# Altium schematic sheet TB_Controller.SchDoc
size A3; SheetNumber: 3; SheetTotal: 3
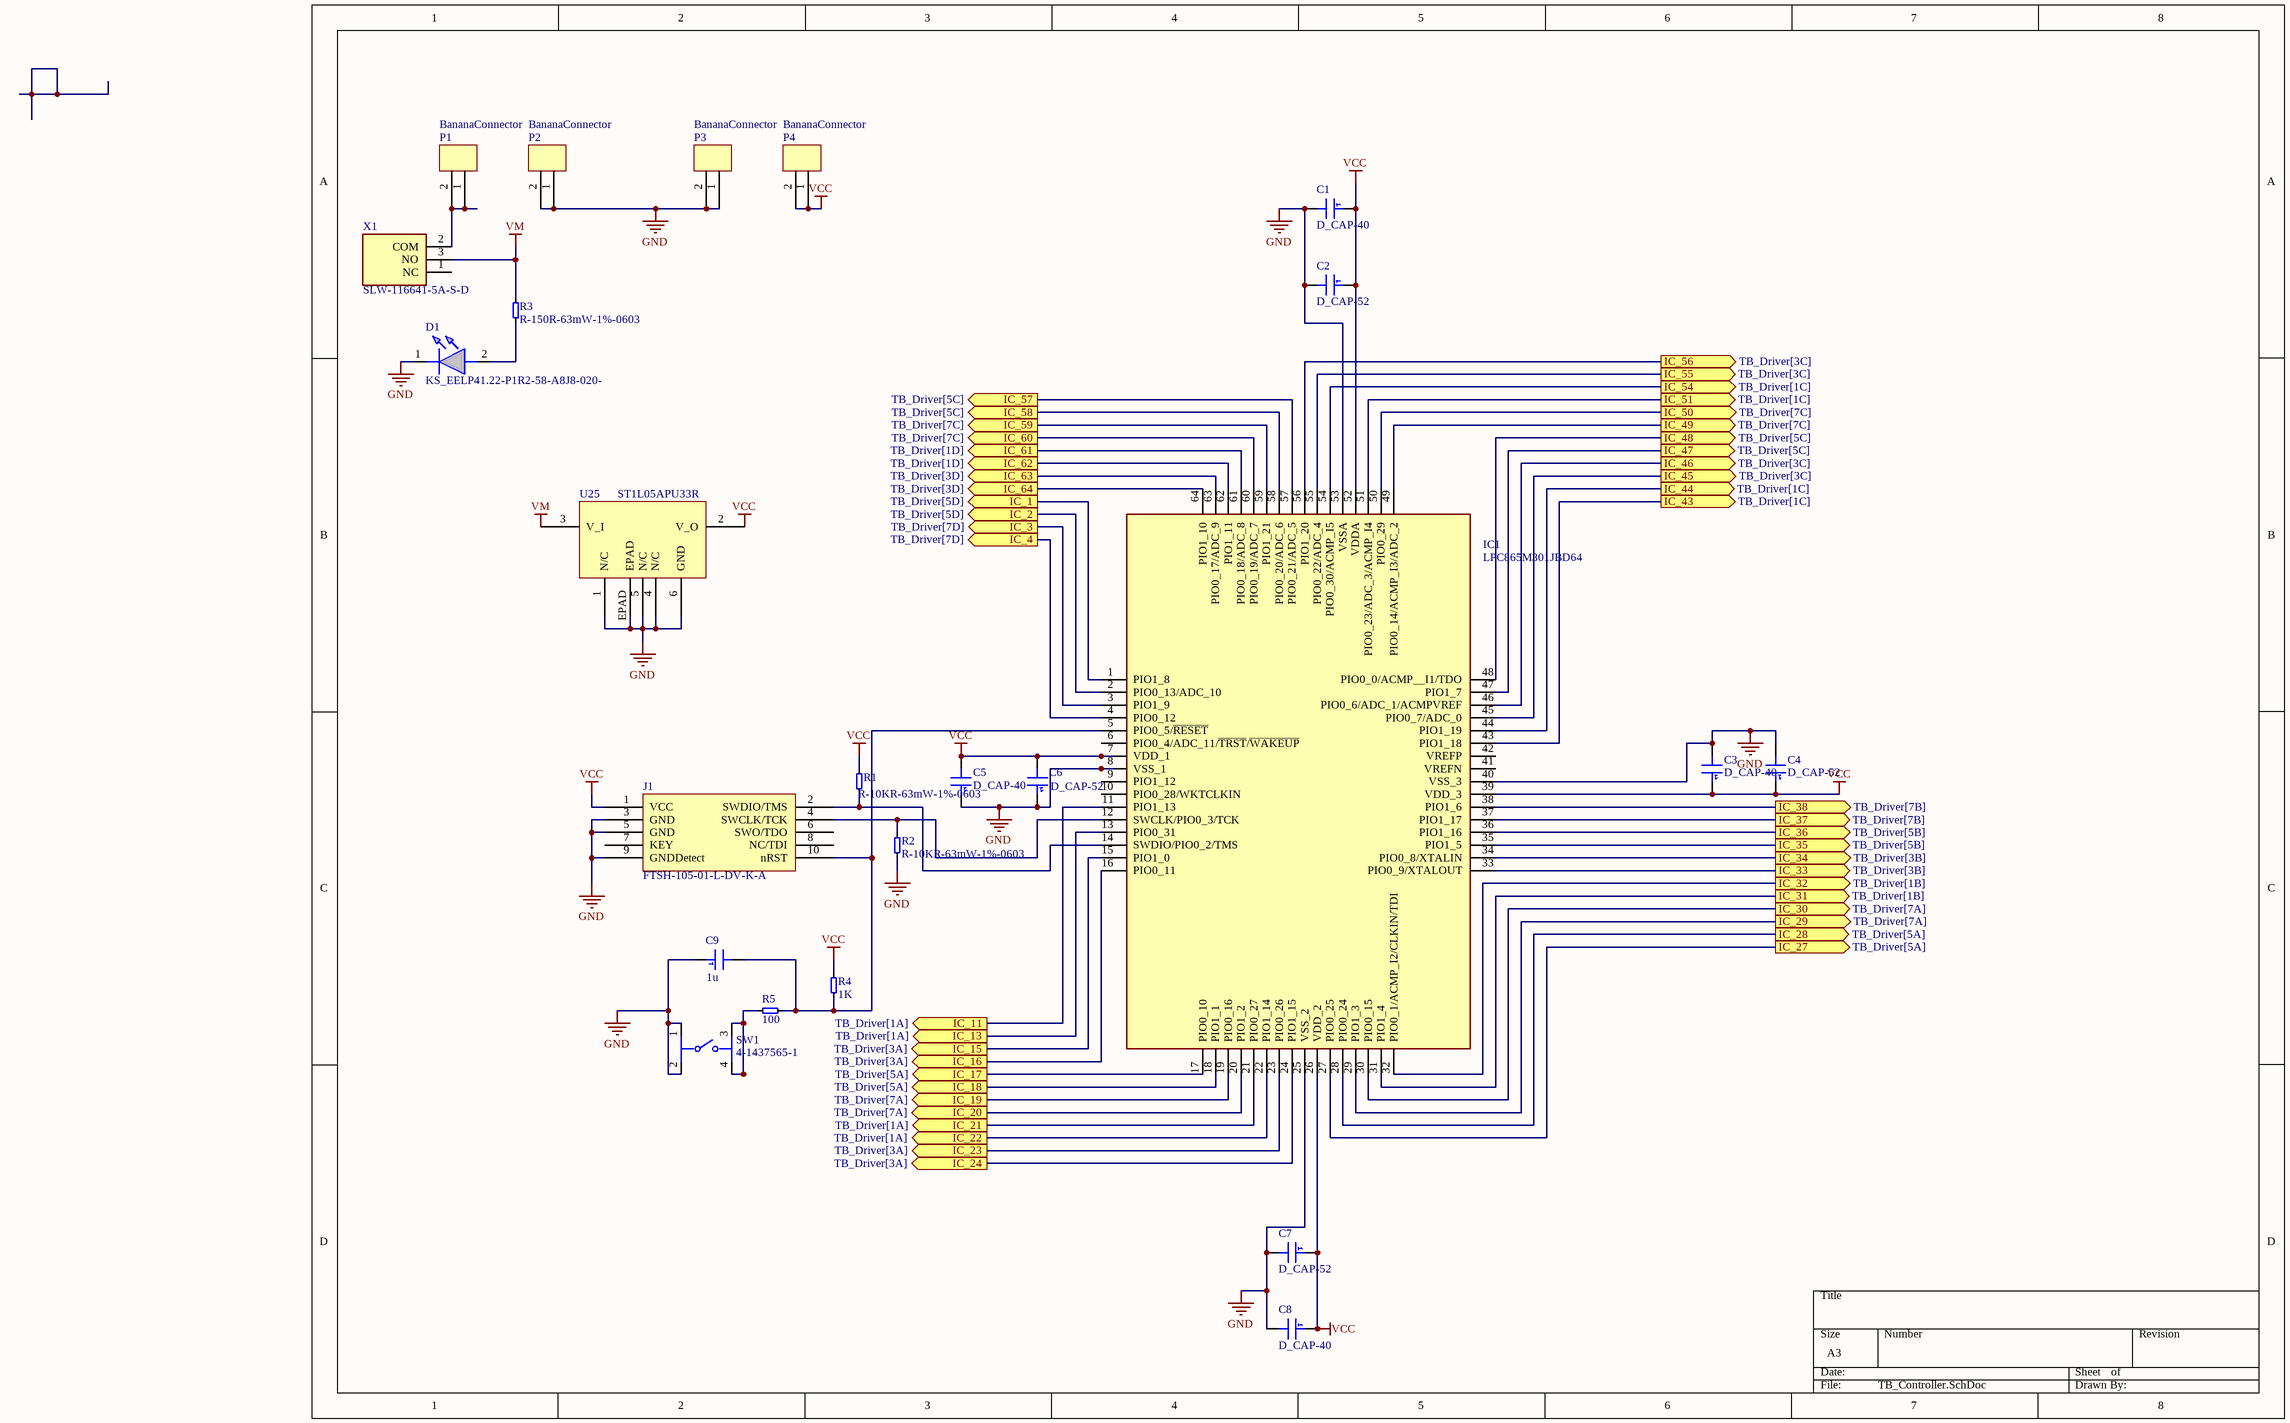
[diagram p0: TB_Controller.SchDoc]

## Parts
C1  D_CAP-40  [CAP_0603H0.8]
C2  D_CAP-52  [CAP_0603H0.8]
C3  D_CAP-40  [CAP_0603H0.8]
C4  D_CAP-52  [CAP_0603H0.8]
C5  D_CAP-40  [CAP_0603H0.8]
C6  D_CAP-52  [CAP_0603H0.8]
C7  D_CAP-52  [CAP_0603H0.8]
C8  D_CAP-40  [CAP_0603H0.8]
C9  1u  [CAP_0603H0.8]
D1  KS_EELP41.22-P1R2-58-A8J8-020-  [KSEELP4122P1R258A8J8020R18]
IC1  LPC865M301JBD64  [LPC865M301JBD64]
J1  FTSH-105-01-L-DV-K-A  [FTSH-105-01-L-DV-K-A]
P1  BananaConnector  [Delton Banana Plug 500 Red]
P2  BananaConnector  [Delton Banana Plug 100 Black]
P3  BananaConnector  [Delton Banana Plug 100 Black]
P4  BananaConnector  [Delton Banana Plug 500 Red]
R1  R-10KR-63mW-1%-0603  [T_RESC0603X30N]
R2  R-10KR-63mW-1%-0603  [T_RESC0603X30N]
R3  R-150R-63mW-1%-0603  [T_RESC0603X30N]
R4  1K  [T_RESC0603X30N]
R5  100  [T_RESC0603X30N]
SW1  4-1437565-1  [FP-4-1437565-1-MFG]
U25  ST1L05APU33R  [ST1L05APU33R]
X1  SLW-116641-5A-S-D  [SLW-116641-5A-S-D]

## Ports
IC_1 (out, see TB_Driver[5D]), IC_2 (out, see TB_Driver[5D]), IC_3 (out, see TB_Driver[7D]), IC_4 (out, see TB_Driver[7D]), IC_11 (out, see TB_Driver[1A]), IC_13 (out, see TB_Driver[1A]), IC_15 (out, see TB_Driver[3A]), IC_16 (out, see TB_Driver[3A]), IC_17 (out, see TB_Driver[5A]), IC_18 (out, see TB_Driver[5A]), IC_19 (out, see TB_Driver[7A]), IC_20 (out, see TB_Driver[7A]), IC_21 (out, see TB_Driver[1A]), IC_22 (out, see TB_Driver[1A]), IC_23 (out, see TB_Driver[3A]), IC_24 (out, see TB_Driver[3A]), IC_27 (out, see TB_Driver[5A]), IC_28 (out, see TB_Driver[5A]), IC_29 (out, see TB_Driver[7A]), IC_30 (out, see TB_Driver[7A]), IC_31 (out, see TB_Driver[1B]), IC_32 (out, see TB_Driver[1B]), IC_33 (out, see TB_Driver[3B]), IC_34 (out, see TB_Driver[3B]), IC_35 (out, see TB_Driver[5B]), IC_36 (out, see TB_Driver[5B]), IC_37 (out, see TB_Driver[7B]), IC_38 (out, see TB_Driver[7B]), IC_43 (out, see TB_Driver[1C]), IC_44 (out, see TB_Driver[1C]), IC_45 (out, see TB_Driver[3C]), IC_46 (out, see TB_Driver[3C]), IC_47 (out, see TB_Driver[5C]), IC_48 (out, see TB_Driver[5C]), IC_49 (out, see TB_Driver[7C]), IC_50 (out, see TB_Driver[7C]), IC_51 (out, see TB_Driver[1C]), IC_54 (out, see TB_Driver[1C]), IC_55 (out, see TB_Driver[3C]), IC_56 (out, see TB_Driver[3C]), IC_57 (out, see TB_Driver[5C]), IC_58 (out, see TB_Driver[5C]), IC_59 (out, see TB_Driver[7C]), IC_60 (out, see TB_Driver[7C]), IC_61 (out, see TB_Driver[1D]), IC_62 (out, see TB_Driver[1D]), IC_63 (out, see TB_Driver[3D]), IC_64 (out, see TB_Driver[3D])

## Nets
GND: C1.2 C2.2 C3.2 C4.2 C5.1 C6.1 C7.2 C8.2 C9.1 D1.1(K) IC1.8(VSS_1) IC1.25(VSS_2) IC1.40(VSS_3) IC1.53(VSSA) J1.3(GND) J1.5(GND) J1.9(GNDDetect) P2.1 P2.2 P3.1 P3.2 R2.1 SW1.1 SW1.2 U25.1(N/C) U25.4(N/C) U25.5(N/C) U25.6(GND) U25.EPAD
VCC: C1.1 C2.1 C3.1 C4.1 C5.2 C6.2 C7.1 C8.1 IC1.7(VDD_1) IC1.26(VDD_2) IC1.39(VDD_3) IC1.52(VDDA) J1.1(VCC) P4.1 P4.2 R1.2 R4.2 U25.2(V_O)
VM: R3.2 U25.3(V_I) X1.3(NO)
IC_1: IC1.1(PIO1_8) ; port IC_1
IC_2: IC1.2(PIO0_13/ADC_10) ; port IC_2
IC_3: IC1.3(PIO1_9) ; port IC_3
IC_4: IC1.4(PIO0_12) ; port IC_4
IC_11: IC1.11(PIO1_13) ; port IC_11
IC_13: IC1.13(PIO0_31) ; port IC_13
IC_15: IC1.15(PIO1_0) ; port IC_15
IC_16: IC1.16(PIO0_11) ; port IC_16
IC_17: IC1.17(PIO0_10) ; port IC_17
IC_18: IC1.18(PIO1_1) ; port IC_18
IC_19: IC1.19(PIO0_16) ; port IC_19
IC_20: IC1.20(PIO1_2) ; port IC_20
IC_21: IC1.21(PIO0_27) ; port IC_21
IC_22: IC1.22(PIO1_14) ; port IC_22
IC_23: IC1.23(PIO0_26) ; port IC_23
IC_24: IC1.24(PIO1_15) ; port IC_24
IC_27: IC1.27(PIO0_25) ; port IC_27
IC_28: IC1.28(PIO0_24) ; port IC_28
IC_29: IC1.29(PIO1_3) ; port IC_29
IC_30: IC1.30(PIO0_15) ; port IC_30
IC_31: IC1.31(PIO1_4) ; port IC_31
IC_32: IC1.32(PIO0_1/ACMP_I2/CLKIN/TDI) ; port IC_32
IC_33: IC1.33(PIO0_9/XTALOUT) ; port IC_33
IC_34: IC1.34(PIO0_8/XTALIN) ; port IC_34
IC_35: IC1.35(PIO1_5) ; port IC_35
IC_36: IC1.36(PIO1_16) ; port IC_36
IC_37: IC1.37(PIO1_17) ; port IC_37
IC_38: IC1.38(PIO1_6) ; port IC_38
IC_43: IC1.43(PIO1_18) ; port IC_43
IC_44: IC1.44(PIO1_19) ; port IC_44
IC_45: IC1.45(PIO0_7/ADC_0) ; port IC_45
IC_46: IC1.46(PIO0_6/ADC_1/ACMPVREF) ; port IC_46
IC_47: IC1.47(PIO1_7) ; port IC_47
IC_48: IC1.48(PIO0_0/ACMP__I1/TDO) ; port IC_48
IC_49: IC1.49(PIO0_14/ACMP_I3/ADC_2) ; port IC_49
IC_50: IC1.50(PIO0_29) ; port IC_50
IC_51: IC1.51(PIO0_23/ADC_3/ACMP_I4) ; port IC_51
IC_54: IC1.54(PIO0_30/ACMP_I5) ; port IC_54
IC_55: IC1.55(PIO0_22/ADC_4) ; port IC_55
IC_56: IC1.56(PIO1_20) ; port IC_56
IC_57: IC1.57(PIO0_21/ADC_5) ; port IC_57
IC_58: IC1.58(PIO0_20/ADC_6) ; port IC_58
IC_59: IC1.59(PIO1_21) ; port IC_59
IC_60: IC1.60(PIO0_19/ADC_7) ; port IC_60
IC_61: IC1.61(PIO0_18/ADC_8) ; port IC_61
IC_62: IC1.62(PIO1_11) ; port IC_62
IC_63: IC1.63(PIO0_17/ADC_9) ; port IC_63
IC_64: IC1.64(PIO1_10) ; port IC_64
NetC9_2: C9.2 IC1.5(PIO0_5/~{RESET}) J1.10(nRST) R4.1 R5.2
NetD1_2: D1.2(A) R3.1
NetIC1_12: IC1.12(SWCLK/PIO0_3/TCK) J1.4(SWCLK/TCK) R2.2
NetIC1_14: IC1.14(SWDIO/PIO0_2/TMS) J1.2(SWDIO/TMS) R1.1
NetP1_1: P1.1 P1.2 X1.2(COM)
NetR5_1: R5.1 SW1.3 SW1.4

Not connected (* = marked no-connect by the designer): IC1 6(PIO0_4/ADC_11/~{TRST}/~{WAKEUP}) 9(PIO1_12) 10(PIO0_28/WKTCLKIN) 41(VREFN) 42(VREFP); J1 6(SWO/TDO) 7(KEY) 8(NC/TDI); X1 1(NC)

## Library data of the parts
C1 C3 C5 C8 = CMP-066-000039-1: Boite Labo 0603: Ceramic Cap, 10nF, 5%, 50V, CAP_0603H0.8; Manufacturer: Murata; ManufacturerPN: GRM1885C1H103JA01D; Tol (%): 5; UnitaryCost: 0; Pol: NO; Designer: R.Mastrocola; Footprint Category: SM_CHIP; DCVoltage (V): 50V; Value: 10nF; HelpURL: http://www.findchips.com/search/GRM1885C1H103JA01D; Type: Ceramic; Supplier1: Mouser; Supplier1PN: 81-GRM1885C1H103JA1D; Projet: Labo; Supplier2PN: -; LatestRevisionDate: 19.02.2015; Part Number: D_CAP-40; Supplier2: -
C2 C4 C6 C7 = CMP-066-000051-1: Boite Labo 0603: Ceramic Cap, 100nF, 10%, 50V, CAP_0603H0.8; Manufacturer: Murata; ManufacturerPN: GCM188L81H104KA57D; F27: Osolète; UnitaryCost: 0.176; Tol (%): 10; Designer: R.Mastrocola; F28: GRM188L81H104KA93D; Pol: NO; Footprint Category: SM_CHIP; Supplier2: -; Supplier1: Mouser; Value: 100nF; DCVoltage (V): 50V; Projet: Labo; LatestRevisionDate: 15.01.2020; Part Number: D_CAP-52; Type: Ceramic; Supplier1PN: 81-GCM188L81H104KA7D; HelpURL: http://www.findchips.com/search/GCM188L81H104KA57D
C9 = CMP-066-000063-1: Boite Labo 0603: Ceramic Cap, 1uF, 10%, 50V, CAP_0603H0.8; ManufacturerPN: GRM188R61H105KAALD; Part Number: D_CAP-64; Manufacturer: Murata; Pol: NO; UnitaryCost: 0.16; Designer: R.Mastrocola; Tol (%): 10; Projet: Labo; Supplier1: Mouser; Supplier1PN: CL10A105KB8NNNC; Value: 1uF; Footprint Category: SM_CHIP; Supplier2PN: 1276-1860-1-ND; DCVoltage (V): 50V; HelpURL: http://www.findchips.com/search/GRM188R61H105KAALD; LatestRevisionDate: 19.02.2015; Type: Ceramic; Supplier2: Digi-Key
D1 = KS_EELP41.22-P1R2-58-A8J8-020-: Standard LEDs - SMD 0603 (1608 metric); Manufacturer_Name: ams OSRAM; Manufacturer_Part_Number: KS EELP41.22-P1R2-58-A8J8-020-R18; Geometry.Height: 0.5mm; Mouser Part Number: 720-P412P1R258A8J802; Mouser Price/Stock: https://www.mouser.co.uk/ProductDetail/ams-OSRAM/KS-EELP41.22-P1R2-58-A8J8-020-R18?qs=ZcfC38r4Povp3XTr6Zxf%252Bw%3D%3D; Datasheet Link: https://www.digikey.ph/en/products/detail/ams-osram-usa-inc/KS-EELP41-22-P1R2-58-A8J8-020-R18/24765247
R1 R2 = CMP-003-0498-1: Resistor 10 Kohm 63mW 1% 0603; Value: 10KR; Component Name: R-10KR-63mW-1%-0603; Rating: 63mW; Source: Ixora.SchLib; Tolerance: 1%
R3 = CMP-003-0154-1: Resistor 150 ohm 63mW 1% 0603; Value: 150R; Tolerance: 1%; Source: Ixora.SchLib; Component Name: R-150R-63mW-1%-0603; Rating: 63mW
R4 = CMP-003-0419-1: Resistor 1 Kohm 63mW 5% 0603; Component Name: R-1KR-63mW-5%-0603; Rating: 63mW; Tolerance: 5%; Source: Ixora.SchLib; Value: 1K
R5 = CMP-003-0496-1: Resistor 100 ohm 63mW 5% 0603; Component Name: R-100R-63mW-5%-0603; Value: 100R; Tolerance: 5%; Source: Ixora.SchLib; Rating: 63mW
SW1 = CMP-03407-000003-1: SWITCH TACTILE SPST-NO 0.05A 24V; Manufacturer: TE Connectivity; Ciiva Ids: 2672442; Contact Current Rating: 50mA; Operating Force: 160gf; Contact Resistance: 100mΩ; Electromechanical Life: 100000Cycles; Standoff Height: 0.05mm; Import Ts: 1521848451; Category: Switch; ComponentLink2Description: Datasheet; Mount: Surface Mount; Digikey Description: SWITCH TACTILE SPST-NO 0.05A 24V; Device Class L3: Tactile Switches; Release Date: 1503379960; Octopart: https://octopart.com/fsm4jsma-te+connectivity-55488004; Temperature Range Low: -35°C; Lead Free: Yes; RoHS: TRUE; Mouser Description: Switch Tactile OFF (ON) SPST Round Button Gull Wing 0.05A 12VDC 1.57N SMD Loose Piece; Voltage Rating Dc: 24V; ComponentLink2URL: https://www.te.com/commerce/DocumentDelivery/DDEController?Action=showdoc&DocId=Customer+Drawing%7F2-1437565-7%7FV%7Fpdf%7FEnglish%7FENG_CD_2-1437565-7_V.pdf%7F4-1437565-1; Height: 5.38mm; Package: 0; Temperature Range High: +85°C; Device Class L2: Switches; Manufacturer Part Number: 4-1437565-1; Temperature: -35°C to +85°C; Device Class L1: Electromechanical; Automotive: No; Throw Configuration: SPST-NO
U25 = ST1L05APU33R: DFN6 (3x3 mm) Input -0.3 to 7V and output 3.3V at max 1.3A
X1 = SLW-116641-5A-S-D: 11.6 x 6 x 4.1 mm, 5 mm Raised Slide Actuator, Through Hole, Slide Switch